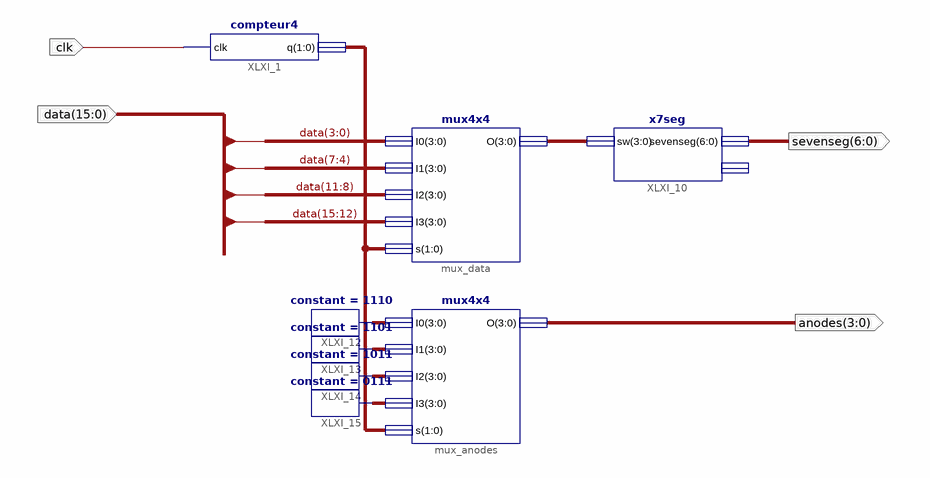
[diagram p0: schematic sheet 1]
// Xilinx ISE schematic afficheur16.sch (spartan3e) as structural Verilog: 8 symbols, 4 ports
module afficheur16 (
  input  clk,
  input  [15:0] data,
  output [6:0] sevenseg,
  output [3:0] anodes
);

  wire [1:0] XLXN_19;
  wire [3:0] XLXN_3, XLXN_21, XLXN_22, XLXN_23, XLXN_24;

  compteur4 XLXI_1 (.clk(clk), .q(XLXN_19));
  mux4x4 mux_data (.I0(data[3:0]), .I1(data[7:4]), .I2(data[11:8]), .I3(data[15:12]), .s(XLXN_19), .O(XLXN_3));
  mux4x4 mux_anodes (.I0(XLXN_21), .I1(XLXN_22), .I2(XLXN_23), .I3(XLXN_24), .s(XLXN_19), .O(anodes));
  x7seg XLXI_10 (.sw(XLXN_3), .sevenseg(sevenseg));  // open: anodes
  constant #(.CValue("1110")) XLXI_12 (.O(XLXN_21));
  constant #(.CValue("1101")) XLXI_13 (.O(XLXN_22));
  constant #(.CValue("1011")) XLXI_14 (.O(XLXN_23));
  constant #(.CValue("0111")) XLXI_15 (.O(XLXN_24));
endmodule
